# EAGLE design Controller Board v11 (EAGLE 5.06)
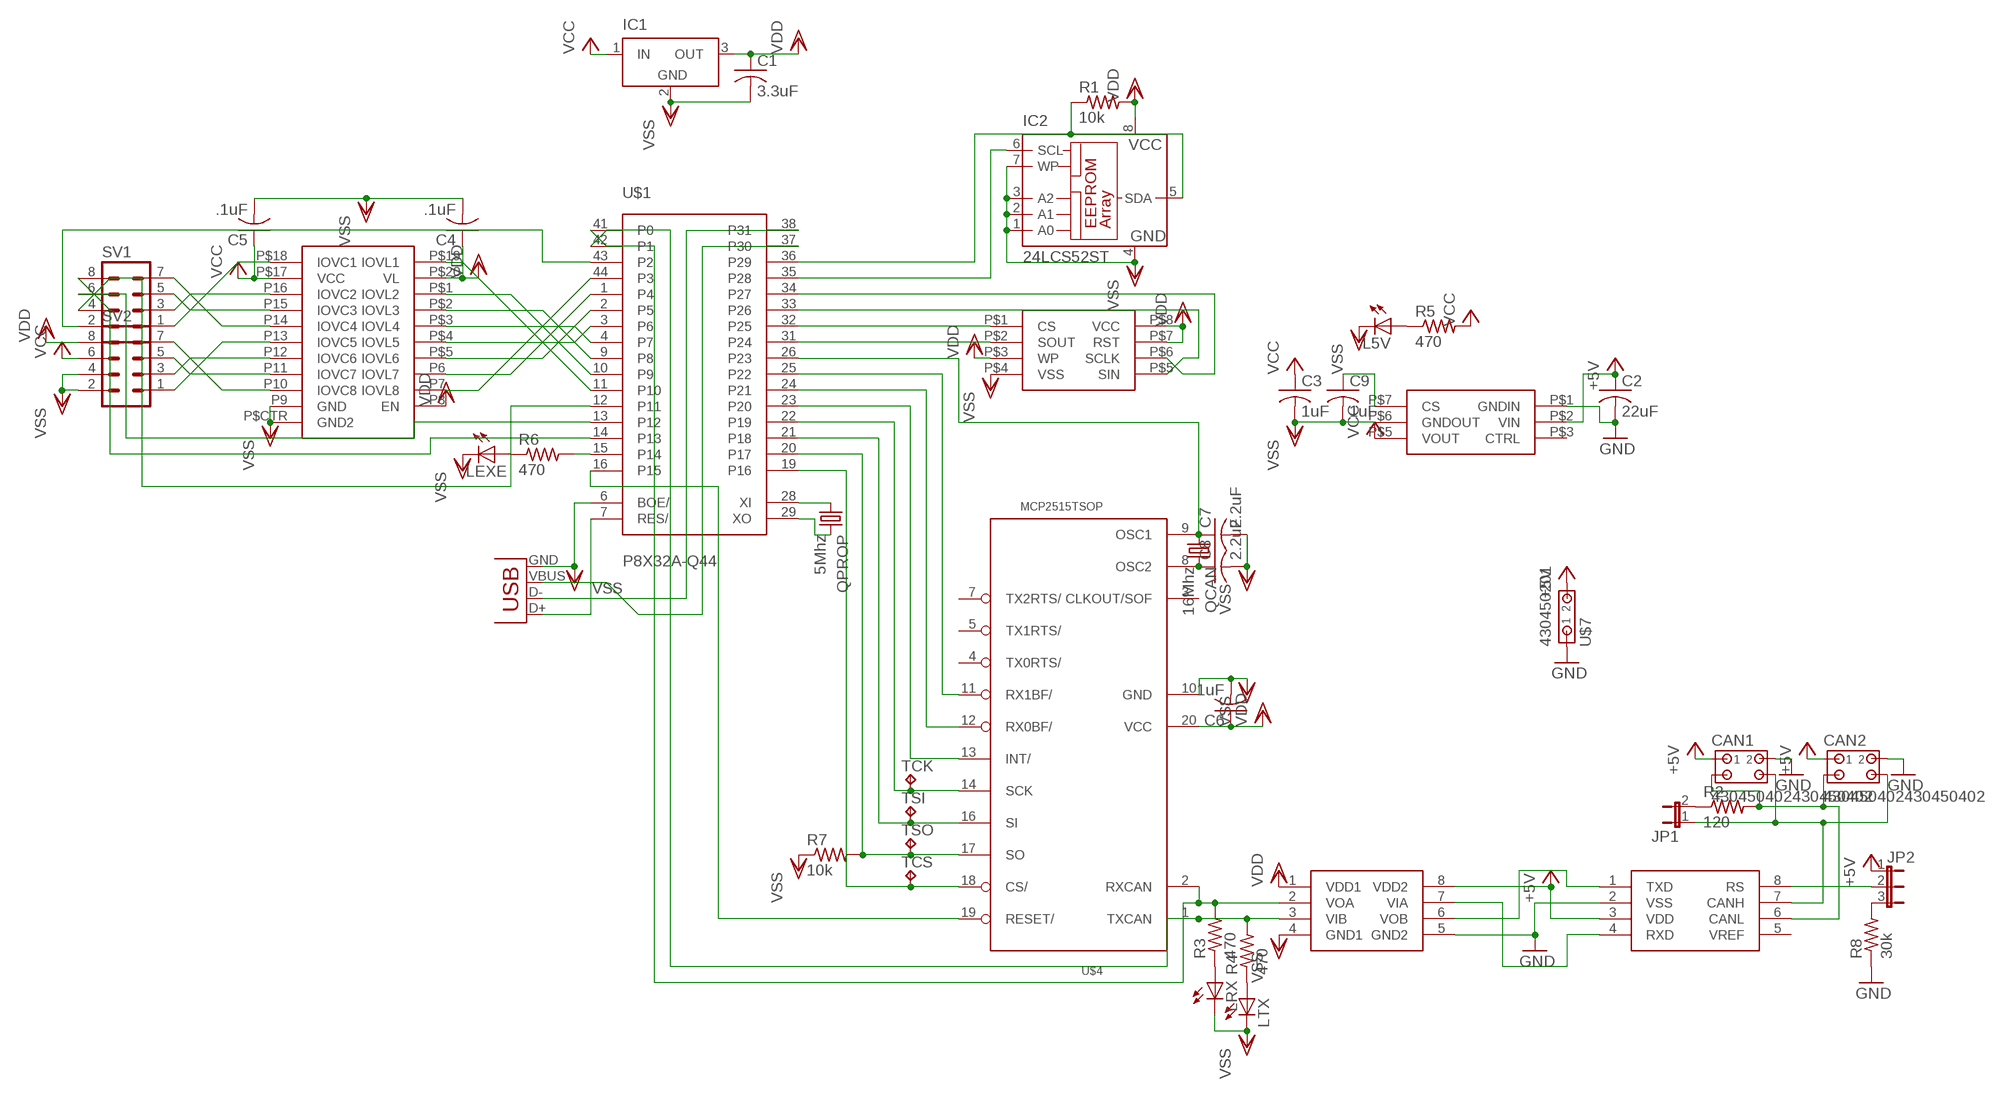
[diagram p0: schematic, sheet 1]

## Parts
C1  3.3uF  C-USC0805  [C0805]
C2  22uF  C-USC1210  [C1210]
C3  1uF  C-USC0805  [C0805]
C4  .1uF  C-USC0805  [C0805]
C5  .1uF  C-USC0805  [C0805]
C6  1uF  C-USC0805  [C0805]
C7  2.2uF  C-USC0805  [C0805]
C8  2.2uF  C-USC0805  [C0805]
C9  1uF  C-USC0805  [C0805]
CAN1  430450402430450402  [430450402]
CAN2  430450402430450402  [430450402]
IC1  LT1129CST5  [SOT223]
IC2  24LCS52ST  [TSSOP8]
JP1  JP1E  [JP1]
JP2  JP2W  [JP2W]
L5V  LEDCHIP-LED0805  [CHIP-LED0805]
LEXE  LEDCHIP-LED0805  [CHIP-LED0805]
LRX  LEDCHIP-LED0805  [CHIP-LED0805]
LTX  LEDCHIP-LED0805  [CHIP-LED0805]
QCAN  16Mhz  CRYSTALHC49UP  [HC49UP]
QPROP  5Mhz  CRYSTALHC49UP  [HC49UP]
R1  10k  R-US_R0603  [R0603]
R2  120  R-US_R0603  [R0603]
R3  470  R-US_R0603  [R0603]
R4  470  R-US_R0603  [R0603]
R5  470  R-US_R0603  [R0603]
R6  470  R-US_R0603  [R0603]
R7  10k  R-US_R0603  [R0603]
R8  30k  R-US_R0603  [R0603]
SV1  MA04-2  [MA04-2]
SV2  MA04-2  [MA04-2]
TCK  TPPAD1-13  [P1-13]
TCS  TPPAD1-13  [P1-13]
TSI  TPPAD1-13  [P1-13]
TSO  TPPAD1-13  [P1-13]
U1  MCP2551  [SO08]
U$1  P8X32A-Q44  [P8X32A-Q44]
U$2  VINF-VWRBS2  [VINF-VWRBS2]
U$3  ADUM1201  [SO8]
U$4  MCP2515TSOP  [TSSOP20]
U$5  M25PE20  [S08N]
U$6  MAX3000E  [TQFN-20]
U$7  430450201  [430450201]
X1  USBSMD  [USB-MINIB]

## Nets
+5V: C2.1 CAN1.P$1 CAN2.P$1 JP2.1 U1.3(VDD) U$2.P$2(VIN) U$3.8(VDD2) U$7.P$2
FLASHCLK: U$1.34(P27) U$5.P$6(SCLK)
FLASHSIN: U$1.33(P26) U$5.P$5(SIN)
GND: C2.2 CAN1.P$2 CAN2.P$2 R8.1 U1.2(VSS) U$2.P$1(GNDIN) U$3.5(GND2) U$7.P$1
N$1: QPROP.1 U$1.28(XI)
N$2: QPROP.2 U$1.29(XO)
N$3: IC2.6(SCL) U$1.35(P28)
N$4: IC2.5(SDA) R1.1 U$1.36(P29)
N$5: U$1.7(RES/) X1.D+
N$6: U$1.38(P31) X1.D-
N$7: U$1.37(P30) X1.VBUS
N$8: U$1.25(P22) U$4.11(RX1BF/)
N$9: U$1.24(P21) U$4.12(RX0BF/)
N$10: CAN1.P$3 CAN2.P$3 R2.2 U1.6(CANL)
N$11: CAN1.P$4 CAN2.P$4 JP1.1 U1.7(CANH)
N$12: R6.2 U$1.15(P14)
N$13: C9.1 U$2.P$7(CS)
N$14: U$1.32(P25) U$5.P$1(CS)
N$15: U$1.31(P24) U$5.P$2(SOUT)
N$16: U$1.23(P20) U$4.13(INT/)
N$17: TCK.1(TP) U$1.22(P19) U$4.14(SCK)
N$18: C7.1 QCAN.1 U$1.26(P23) U$4.9(OSC1)
N$19: C8.1 QCAN.2 U$4.8(OSC2)
N$20: R3.2 U$1.41(P0) U$3.2(VOA) U$4.2(RXCAN)
N$21: R4.2 U$1.42(P1) U$3.3(VIB) U$4.1(TXCAN)
N$22: JP1.2 R2.1
N$23: TSI.1(TP) U$1.21(P18) U$4.16(SI)
N$24: TCS.1(TP) U$1.19(P16) U$4.18(CS/)
N$25: U$1.16(P15) U$4.19(RESET/)
N$26: LRX.A R3.1
N$27: U$1.11(P10) U$6.P$19(IOVL1)
N$28: SV2.7 U$6.P10(IOVC8)
N$29: SV2.5 U$6.P11(IOVC7)
N$30: U$1.10(P9) U$6.P$1(IOVL2)
N$31: U$1.9(P8) U$6.P$2(IOVL3)
N$32: U$1.4(P7) U$6.P$3(IOVL4)
N$33: U$1.3(P6) U$6.P$4(IOVL5)
N$34: U$1.2(P5) U$6.P$5(IOVL6)
N$35: U$1.1(P4) U$6.P6(IOVL7)
N$36: U$1.44(P3) U$6.P7(IOVL8)
N$37: SV2.3 U$6.P12(IOVC6)
N$38: SV2.1 U$6.P13(IOVC5)
N$39: SV1.7 U$6.P14(IOVC4)
N$40: SV1.1 U$6.P$18(IOVC1)
N$41: SV1.3 U$6.P16(IOVC2)
N$42: SV1.5 U$6.P15(IOVC3)
N$43: SV1.8 U$1.14(P13)
N$44: R7.2 TSO.1(TP) U$1.20(P17) U$4.17(SO)
N$45: SV1.6 U$1.13(P12)
N$46: LTX.A R4.1
N$47: L5V.A R5.1
N$48: LEXE.A R6.1
N$49: SV1.4 U$1.12(P11)
N$50: SV1.2 U$1.43(P2)
N$51: JP2.2 U1.8(RS)
N$52: JP2.3 R8.2
N$53: U1.1(TXD) U$3.6(VOB)
N$54: U1.4(RXD) U$3.7(VIA)
VCC: C3.1 C5.1 IC1.1(IN) R5.2 SV2.6 U$2.P$5(VOUT) U$6.P$17(VCC)
VDD: C1.1 C4.1 C6.1 IC1.3(OUT) IC2.8(VCC) R1.2 SV2.8 U$3.1(VDD1) U$4.20(VCC) U$5.P$3(WP) U$5.P$7(RST) U$5.P$8(VCC) U$6.P8(EN) U$6.P$20(VL)
VSS: C1.2 C3.2 C4.2 C5.2 C6.2 C7.2 C8.2 C9.2 IC1.2(GND) IC2.1(A0) IC2.2(A1) IC2.3(A2) IC2.4(GND) IC2.7(WP) L5V.C LEXE.C LRX.C LTX.C R7.1 SV2.2 SV2.4 U$1.6(BOE/) U$2.P$6(GNDOUT) U$3.4(GND1) U$4.10(GND) U$5.P$4(VSS) U$6.P9(GND) U$6.P$CTR(GND2) X1.GND
Unconnected: U1.5(VREF) U$2.P$3(CTRL) U$4.3(CLKOUT/SOF) U$4.4(TX0RTS/) U$4.5(TX1RTS/) U$4.7(TX2RTS/)

## Power pins joined to a net without a drawn wire
VDD: U$1.8(VDD) U$1.18(VDD) U$1.30(VDD) U$1.40(VDD)
VSS: IC1.4(GND) U$1.5(VSS) U$1.17(VSS) U$1.27(VSS) U$1.39(VSS)

## Library data of the parts
C1 C2 C4-C8 = rcl:C-US: CAPACITOR, American symbol
C3 C9 = resistor:C-US: CAPACITOR, American symbol
CAN1 CAN2 = con-amp:430450402
IC1 = linear-technology:LT1129CST5: VOLTAGE REGULATOR with shutdown
IC2 = microchip:24*: Serial EEPROM I2C
JP1 = jumper:JP1E: JUMPER
JP2 = jumper:JP2W: JUMPER
L5V LEXE LRX LTX = led:LED: LED OSRAM: - CHIPLED LG R971, LG N971, LY N971, LG Q971, LY Q971, LO R971, LY R971 LH N974, LH R974 LS Q976, LO Q976, LY Q976 LO Q996 - Hyper CHIPLED LW Q18S LB Q993, LB Q99A, LB R99A - SideLED LS A670, LO A670, LY A670, LG A670, LP A670 LB A673, LV A673, LT A673, LW A673 LH A674 LY A675 LS A676, LA A676, LO A676, LY A676, LW A676 LS A679, LY A679, LG A679 - Hyper Micro SIDELED® LS Y876, LA Y876, LO Y876, LY Y876 LT Y87S - SmartLED LW L88C, LW L88S LB L89C, LB L89S, LG L890 LS L89K, LO L89K, LY L89K LS L896, LA L896, LO L896, LY L896 - TOPLED LS T670, LO T670, LY T670, LG T670, LP T670 LSG T670, LSP T670, LSY T670, LOP T670, LYG T670 LG T671, LOG T671, LSG T671 LB T673, LV T673, LT T673, LW T673 LH T674 LS T676, LA T676, LO T676, LY T676, LB T676, LH T676, LSB T676, LW T676 LB T67C, LV T67C, LT T67C, LS T67K, LO T67K, LY T67K, LW E67C LS E67B, LA E67B, LO E67B, LY E67B, LB E67C, LV E67C, LT E67C LW T67C LS T679, LY T679, LG T679 LS T770, LO T770, LY T770, LG T770, LP T770 LB T773, LV T773, LT T773, LW T773 LH T774 LS E675, LA E675, LY E675, LS T675 LS T776, LA T776, LO T776, LY T776, LB T776 LHGB T686 LT T68C, LB T68C - Hyper Mini TOPLED® LB M676 - Mini TOPLED Santana® LG M470 LS M47K, LO M47K, LY M47K Source: http://www.osram.convergy.de LUXEON: - LUMILED® LXK2-PW12-R00, LXK2-PW12-S00, LXK2-PW14-U00, LXK2-PW14-V00 LXK2-PM12-R00, LXK2-PM12-S00, LXK2-PM14-U00 LXK2-PE12-Q00, LXK2-PE12-R00, LXK2-PE12-S00, LXK2-PE14-T00, LXK2-PE14-U00 LXK2-PB12-K00, LXK2-PB12-L00, LXK2-PB12-M00, LXK2-PB14-N00, LXK2-PB14-P00, LXK2-PB14-Q00 LXK2-PR12-L00, LXK2-PR12-M00, LXK2-PR14-Q00, LXK2-PR14-R00 LXK2-PD12-Q00, LXK2-PD12-R00, LXK2-PD12-S00 LXK2-PH12-R00, LXK2-PH12-S00 LXK2-PL12-P00, LXK2-PL12-Q00, LXK2-PL12-R00 Source: www.luxeon.com KINGBRIGHT: KA-3528ASYC Source: www.kingbright.com
QCAN QPROP = crystal:CRYSTAL: CRYSTAL
R1-R8 = rcl:R-US_: RESISTOR, American symbol
SV1 SV2 = con-lstb:MA04-2: PIN HEADER
TCK TCS TSI TSO = testpad:TP: Test pad
U1 = SparkFun:MCP2551
U$1 = parallax_propeller:P8X32A-Q44
U$2 = dc-dc-converter:VINF-VWRBS2
U$3 = analog-devices:ADUM1201
U$4 = MCP2515_MT:MCP2515*: MCP2515 Standalone CAN-Controller by Microchip Eagle-Lib. by MartinThomas
U$5 = Flash:M25PE20
U$6 = Level Shifters:MAX3000E
U$7 = con-amp:430450201
X1 = SparkFun:USB: USB Connectors USB-B-PTH is fully proven SKU : PRT-00139 USB-miniB is fully proven SKU : PRT-00587 USB-A-PCB is untested. USB-A-H is throughly reviewed, but untested. Spark Fun Electronics SKU : PRT-00437 USB-B-SMT is throughly reviewed, but untested. Needs silkscreen touching up. USB-A-S has not been used/tested USB-MB-H has not been used/tested

## Board
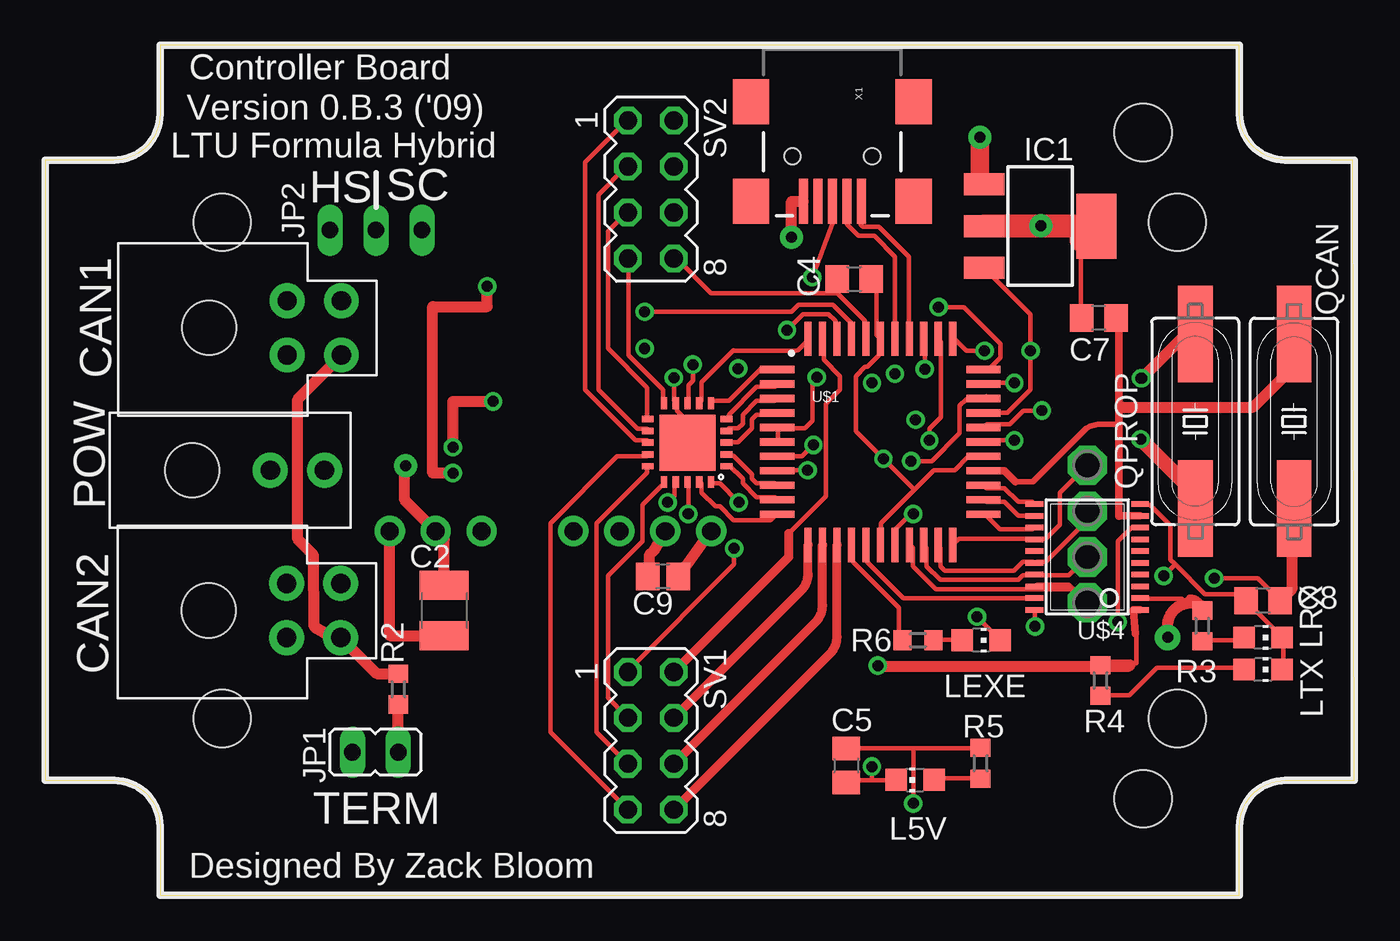
[diagram p1: board, top side]
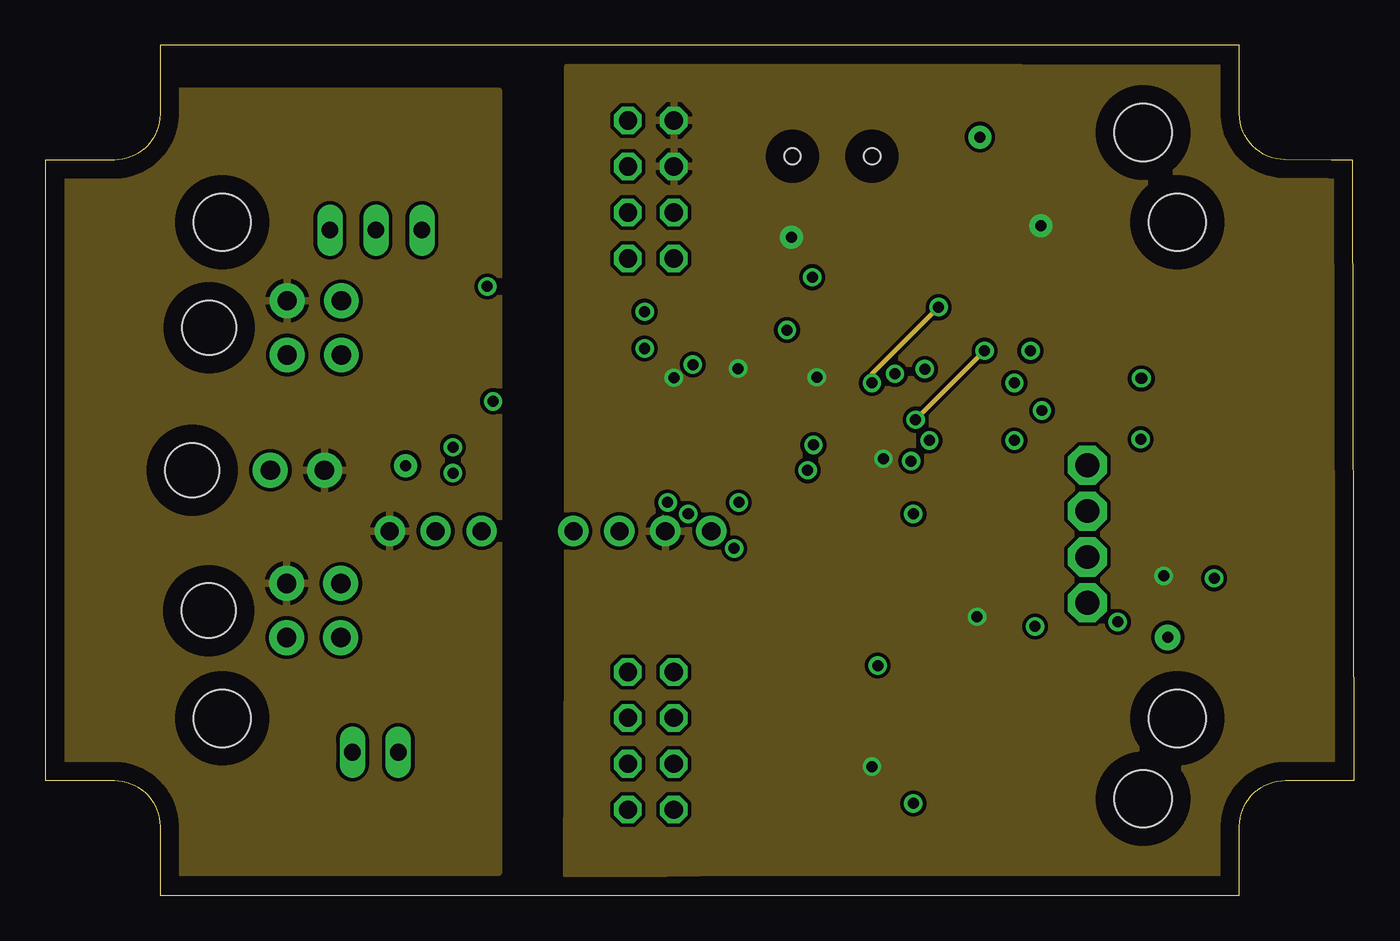
[diagram p2: board, inner layer Route2]
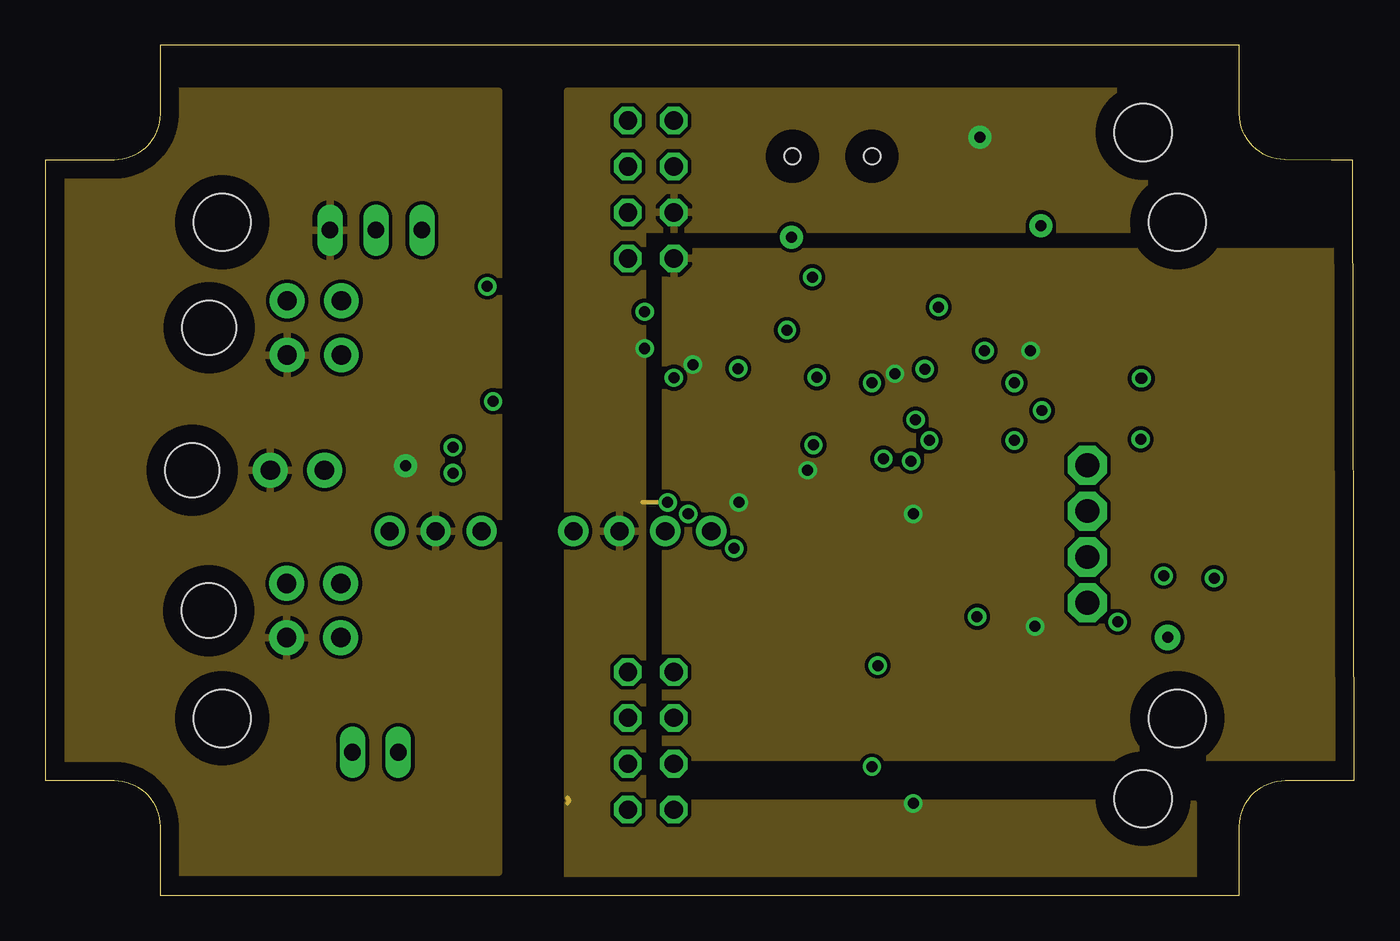
[diagram p3: board, inner layer Route15]
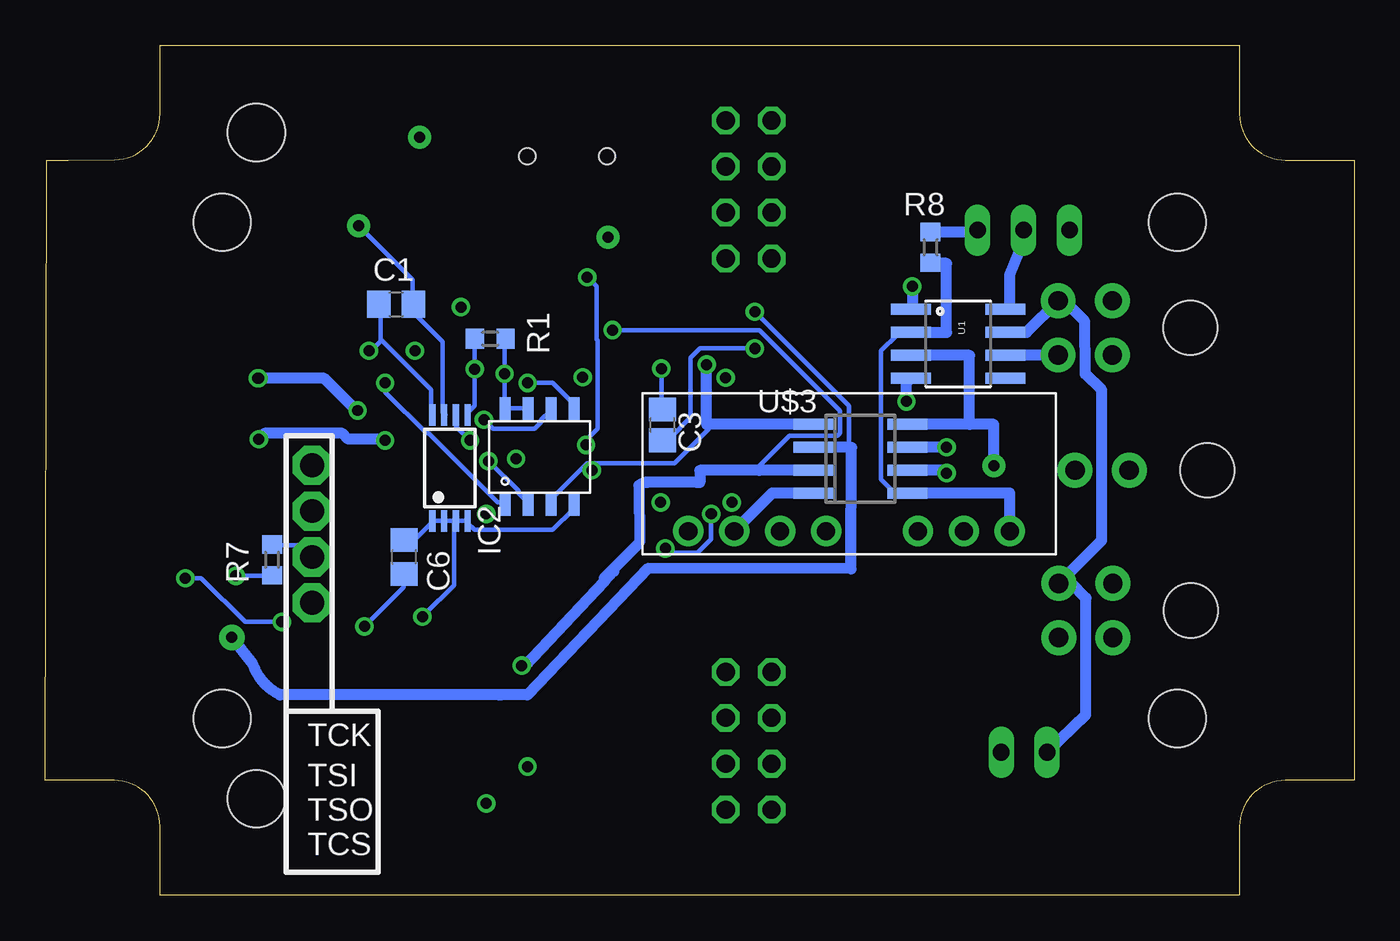
[diagram p4: board, bottom side, seen from below]

Size 72.39 x 46.99 mm. Coordinates in mm from the lower left corner, seen from the top.
Outline: 72.39,6.35 72.31,40.64 71.12,40.64 68.56,40.66 arc-89 66.04,43.2 66.04,46.99 6.35,46.99 6.35,43.18 arc-90 3.81,40.64 0,40.64 0,6.35 3.81,6.35 arc-90 6.35,3.81 6.35,0 66.04,0 66.04,3.81 arc-90 68.58,6.35 72.39,6.35
Copper layers (1*2+15*16): Top 0.035mm / dielectric 0.2mm / Route2 0.035mm / dielectric 1.5mm / Route15 0.035mm / dielectric 0.2mm / Bottom 0.035mm
Design rules "4 layer": minimum track width 10mil, minimum drill 24mil, track to track 8mil, track to pad 8mil, pad to pad 8mil, via to via 8mil, smd to smd 8mil, copper to edge 40mil, drill to drill 8mil, minimum pad ring 10mil, minimum via ring 8mil, stop-mask expansion 4mil, vias tented up to drill 0mil, thermal gap 10mil
Holes 3.17 mm at 62.61,37.21 62.61,9.78 9.78,9.78 9.78,37.21 60.71,5.33 60.71,42.16
tKeepout: area 26.3,6.7 to 27,39.1

### Footprints (pad centres in the part's own frame; a part is rotated, then mirrored left to right if it is on the bottom)
C0805 = smd 1.3 x 1.5: 1 -0.95,0; 2 0.95,0
C1210 = smd 1.6 x 2.7: 1 -1.4,0; 2 1.4,0
C0805' = smd 1.3 x 1.5: 1 -0.85,0; 2 0.85,0
430450402 = drill 1.067 pad 1.93 round: P$1 2.997,2.997; P$2 0,2.997; P$3 2.997,5.994; P$4 0,5.994 | hole 2.997: 1.499,-1.321
SOT223 = smd 1.219 x 2.235: 1 -2.311,-3.099; 2 0,-3.099; 3 2.311,-3.099 | smd 3.6 x 2.2: 4 0,3.099
TSSOP8 = smd 0.35 x 1.2: 1 -0.975,-2.925; 2 -0.325,-2.925; 3 0.325,-2.925; 4 0.975,-2.925; 5 0.975,2.925; 6 0.325,2.925; 7 -0.325,2.925; 8 -0.975,2.925
JP1 = drill 0.914 long: 1 0,-1.27; 2 0,1.27
JP2W = drill 0.914 long: 1 -2.54,-1.27; 2 0,-1.27; 3 2.54,-1.27
CHIP-LED0805 = smd 1.2 x 1.2: A 0,-1.05; C 0,1.05
HC49UP = smd 5.334 x 1.93: 1 -4.826,0; 2 4.826,0
R0603 = smd 1 x 1.1: 1 -0.85,0; 2 0.85,0
MA04-2 = drill 1.016 octagon: 1 -3.81,-1.27; 2 -3.81,1.27; 3 -1.27,-1.27; 4 -1.27,1.27; 5 1.27,-1.27; 6 1.27,1.27; 7 3.81,-1.27; 8 3.81,1.27
P1-13 = drill 1.321 pad 2.159 octagon: 1 0,0
SO08 = smd 0.61 x 2.21: 1 -1.905,-2.616; 2 -0.635,-2.616; 3 0.635,-2.616; 4 1.905,-2.616; 5 1.905,2.616; 6 0.635,2.616; 7 -0.635,2.616; 8 -1.905,2.616
P8X32A-Q44 = smd 1.9 x 0.4: 1 -5.713,4.013; 2 -5.713,3.212; 3 -5.713,2.413; 4 -5.713,1.613; 5 -5.713,0.812; 6 -5.713,0.013; 7 -5.713,-0.787; 8 -5.713,-1.587; 9 -5.713,-2.388; 10 -5.713,-3.188; 11 -5.713,-3.987; 23 5.688,-3.987; 24 5.688,-3.188; 25 5.688,-2.388; 26 5.688,-1.587; 27 5.688,-0.787; 28 5.688,0.013; 29 5.688,0.812; 30 5.688,1.613; 31 5.688,2.413; 32 5.688,3.212; 33 5.688,4.013 | smd 0.4 x 1.9: 12 -4.013,-5.688; 13 -3.212,-5.688; 14 -2.413,-5.688; 15 -1.613,-5.688; 16 -0.812,-5.688; 17 -0.013,-5.688; 18 0.787,-5.688; 19 1.587,-5.688; 20 2.388,-5.688; 21 3.188,-5.688; 22 3.987,-5.688; 34 3.987,5.713; 35 3.188,5.713; 36 2.388,5.713; 37 1.587,5.713; 38 0.787,5.713; 39 -0.013,5.713; 40 -0.812,5.713; 41 -1.613,5.713; 42 -2.413,5.713; 43 -3.212,5.713; 44 -4.013,5.713
VINF-VWRBS2 = drill 1 pad 1.676 round: P$1 -12.7,5.08; P$2 -10.16,5.08; P$3 -7.62,5.08; P$4 -2.54,5.08; P$5 0,5.08; P$6 2.54,5.08; P$7 5.08,5.08
SO8 = smd 0.6 x 2.2: 1 -1.905,-2.6; 2 -0.635,-2.6; 3 0.635,-2.6; 4 1.905,-2.6; 5 1.905,2.6; 6 0.635,2.6; 7 -0.635,2.6; 8 -1.905,2.6
TSSOP20 = smd 0.305 x 0.991: 1 -2.925,-2.918; 2 -2.275,-2.918; 3 -1.625,-2.918; 4 -0.975,-2.918; 5 -0.325,-2.918; 6 0.325,-2.918; 7 0.975,-2.918; 8 1.625,-2.918; 9 2.275,-2.918; 10 2.925,-2.918; 11 2.925,2.918; 12 2.275,2.918; 13 1.625,2.918; 14 0.975,2.918; 15 0.325,2.918; 16 -0.325,2.918; 17 -0.975,2.918; 18 -1.625,2.918; 19 -2.275,2.918; 20 -2.925,2.918
S08N = smd 0.6 x 1.3: P$1 -2.54,-2.667; P$2 -1.27,-2.667; P$3 0,-2.667; P$4 1.27,-2.667; P$5 1.27,2.587; P$6 0,2.587; P$7 -1.27,2.587; P$8 -2.54,2.587
TQFN-20 = smd 0.65 x 0.35: P6 0.875,-1.1; P7 0.875,-0.45; P8 0.875,0.2; P9 0.875,0.85; P10 0.875,1.5; P16 -3.475,1.5; P$17 -3.475,0.85; P$18 -3.475,0.2; P$19 -3.475,-0.45; P$20 -3.475,-1.1 | smd 0.35 x 0.65: P11 0,2.4; P12 -0.65,2.4; P13 -1.3,2.4; P14 -1.95,2.4; P15 -2.6,2.4; P$1 -2.6,-1.95; P$2 -1.95,-1.95; P$3 -1.3,-1.95; P$4 -0.65,-1.95; P$5 0,-1.95 | smd 3.099 x 3.099: P$CTR -1.3,0.2
430450201 = drill 1.067 pad 1.93 round: P$1 0,2.997; P$2 0,0 | hole 2.997: 0,-4.318
USB-MINIB = smd 2.5 x 0.5: D+ 2.5,0; D- 2.5,0.8; GND 2.5,-1.6; ID 2.5,-0.8; VBUS 2.5,1.6 | smd 2.5 x 2: GND@1 -3,-4.5; GND@2 -3,4.5; GND@3 2.5,4.5; GND@4 2.5,-4.5 | hole 0.9: 0,2.2; 0,-2.2

### Placement (x,y rotation side)
C1  52.99,32.67 0 bottom
C2  22.07,15.75 270 top
C3  1uF  [C0805']  38.26,26 90 bottom
C4  44.74,34.07 0 top
C5  44.29,7.18 270 top
C6  52.55,18.7 90 bottom
C7  58.26,31.91 180 top
C8  67.34,16.29 180 top
C9  1uF  [C0805']  34.16,17.62 180 top
CAN1  10.38,32.86 270 top
CAN2  10.35,17.24 270 top
IC1  55.02,36.99 270 top
IC2  50.01,23.62 0 bottom
JP1  18.26,7.91 270 top
JP2  18.29,38.04 0 top
L5V  48.1,6.38 90 top
LEXE  51.75,14.1 270 top
LRX  67.34,14.26 270 top
LTX  67.34,12.48 270 top
QCAN  69.06,26.19 270 top
QPROP  63.6,26.19 90 top
R1  47.78,30.77 0 bottom
R2  19.53,11.4 90 top
R3  63.98,14.89 90 top
R4  58.36,11.87 90 top
R5  51.72,7.3 90 top
R6  48.26,14.1 180 top
R7  59.85,18.54 90 bottom
R8  23.43,35.81 90 bottom
SV1  33.5,8.54 270 top
SV2  33.5,39.02 270 top
TCK  57.63,23.78 0 top
TCS  57.63,16.16 0 top
TSI  57.63,21.24 0 top
TSO  57.63,18.7 0 top
U1  21.91,30.48 270 bottom
U$1  46.2,25.05 0 top
U$2  31.75,25.21 180 bottom
U$3  27.3,24.13 270 bottom
U$4  57.63,18.7 90 top
U$5  44.42,24.29 0 bottom
U$6  35.72,26.32 90 top
U$7  12.45,23.5 270 top
X1  43.53,40.86 270 top

### Tracks (layer width: path | path; a pad name or v marks a point on that pad's centre or on a via)
+5V  (via drill 0.61 pad 1.27)
  Top 0.61: C2.1 22.07,19.65 U$2.P$2 19.88,21.84 19.88,23.81
  Bottom 0.61: 21.27,26.04 U$3.8 | U1.3 21.27,29.84 21.27,26.04 | 21.27,26.04 19.94,26.04 v19.94,23.75
  pour Route15: 1.27,44.45 1.27,1.27 25.08,1.27 25.08,44.45
FLASHCLK  (via drill 0.61)
  Top 0.254: v51.94,30.1 50.93,30.1 50.29,30.73 U$1.34
  Route2 0.254: v48.13,26.29 v51.94,30.1
  Bottom 0.254: v48.13,26.29 47.62,25.78 45.34,25.78 44.96,26.16 44.96,26.29 44.45,26.8 U$5.P$6
FLASHSIN  (via drill 0.61)
  Top 0.254: v49.4,32.51 50.8,32.51 52.83,30.48 52.83,29.72 52.2,29.08 51.94,29.08 U$1.33
  Route2 0.254: v45.72,28.32 45.72,28.83 v49.4,32.51
  Bottom 0.254: v45.72,28.32 44.32,28.32 43.18,27.18 43.18,26.92 U$5.P$5
GND
  Top 0.61: C2.2 19.05,14.35 U$2.P$1
  Bottom 0.254: U1.2 24.77,30.99 25.27,30.99 26.16,30.1 26.16,22.99 25.53,22.35 24.89,22.35 U$3.5
  Bottom 0.61: U$3.5 19.05,22.23 U$2.P$1 | U1.2 22.54,31.11 22.54,34.92 23.43,34.92 R8.1
  pour Route2: 25.08,44.45 25.08,1.27 1.27,1.27 1.27,44.45
N$1  (via drill 0.61)
  Top 0.254: v53.59,25.15 51.94,25.15 U$1.28 | 63.63,21.34 QPROP.1
  Top 0.61: v53.59,25.15 53.66,25.21
  Top 0.813: 63.63,21.34 63.63,22.16 v60.58,25.21
  Bottom 0.61: v60.58,25.21 60.26,25.53 55.94,25.53 55.63,25.21 53.59,25.21 v53.59,25.15
N$2  (via drill 0.6)
  Top 0.254: v55.12,26.8 54.1,26.8 53.34,26.04 52.07,26.04 51.94,25.91 U$1.29
  Top 0.61: QPROP.2 63.09,31.02 v60.64,28.57
  Bottom 0.254: v55.12,26.8 55.15,26.77
  Bottom 0.61: v60.64,28.57 56.96,28.57 55.15,26.77 55.12,26.73
N$3  (via drill 0.61)
  Top 0.254: v48.9,25.15 48.9,25.78 49.53,26.42 49.53,30.61 49.4,30.73 U$1.35
  Bottom 0.254: v48.9,25.15 49.66,25.91 49.66,26.54 IC2.6
N$4  (via drill 0.61)
  Top 0.254: v48.64,29.08 48.64,30.73 U$1.36
  Bottom 0.254: R1.1 48.64,30.73 v48.64,29.08 48.64,27.05 49.02,26.67 IC2.5
N$5  (via drill 0.61)
  Top 0.254: v42.42,34.16 43.56,37.21 43.56,38.35 X1.D+ | U$1.7 40.51,24.26 41.85,24.26 v42.48,24.89
  Bottom 0.254: v42.48,24.89 42.48,25.15 41.85,25.78 41.85,30.67 41.91,30.73 41.91,33.66 v42.42,34.16
N$6
  Top 0.254: U$1.38 46.99,30.86 46.99,35.31 45.85,36.45 44.96,36.45 44.32,37.08 X1.D-
N$7
  Top 0.254: U$1.37 47.75,30.86 47.75,35.31 46.1,36.96 45.21,36.96 45.09,37.08 45.09,38.35 X1.VBUS
N$8
  Top 0.254: U$4.11 54.58,21.75 53.82,21.75 53.05,22.51 52.04,22.51 U$1.25
N$9
  Top 0.254: U$1.24 52.04,21.75 53.05,21.75 53.82,20.99 54.58,20.99 U$4.12
N$10
  Top 0.61: R2.2 18.34,12.25 CAN2.P$3 15.92,14.24 14.87,14.86 14.83,18.79 13.97,19.68 13.97,27.42 16.38,29.83 CAN1.P$3
  Bottom 0.61: U1.6 19.27,29.86 CAN1.P$3
N$11
  Bottom 0.61: U1.7 18.12,31.11 CAN1.P$4 16.03,32.86 14.91,31.73 14.87,28.82 13.97,27.94 13.97,19.61 CAN2.P$4 15.65,17.24 14.83,16.43 14.85,9.97 JP1.1
N$12
  Top 0.254: R6.2 47.21,14.13 47.21,15.91 44.67,18.45 44.67,19.21 U$1.15
N$13
  Top 0.61: C9.1 U$2.P$7
N$14  (via drill 0.61)
  Top 0.254: v53.59,28.32 51.94,28.32 U$1.32
  Bottom 0.254: v53.59,28.32 53.59,27.81 51.31,25.53 51.18,25.53 47.37,21.72 46.99,21.72 U$5.P$1
N$15  (via drill 0.61)
  Top 0.254: 52.04,27.59 U$1.31 51.82,27.43 50.93,27.43 50.55,27.05 50.55,25.53 49.02,24 v47.88,24
  Bottom 0.254: v47.88,24 46.23,22.35 46.23,22.23 45.72,21.72 U$5.P$2
N$16
  Top 0.254: U$4.13 54.58,20.23 52.8,20.23 52.04,20.99 U$1.23
N$17
  Top 0.254: U$1.22 50.26,19.46 50.51,19.72 54.58,19.72 U$4.14 54.83,19.72 55.34,19.72 56.1,20.48 56.1,22.26 TCK.1 | TCK.1
N$18
  Top 0.254: 59.31,31.88 C7.1 | 68.96,30.99 QCAN.1 | 59.37,26.73 59.44,26.73 59.56,26.99
  Top 0.305: 53.66,22.86 54.61,22.86 57.41,25.66 arc-45 58.31,26.04 59.37,26.04
  Top 0.406: 59.31,31.88 59.37,31.81 59.37,26.73 59.37,26.04 59.37,20.95 59.39,20.98 U$4.9 | U$1.26 53.05,23.46 53.66,22.86
  Top 0.61: 68.96,30.99 68.96,29.15 66.8,26.99 59.56,26.99
N$19  (via drill 0.61)
  Top 0.254: v59.31,15.11 59.31,19.56 60.07,20.32 60.45,20.32 U$4.8 | v64.64,17.53 67.06,17.53 68.2,16.38 C8.1 | 68.96,21.34 QCAN.2
  Top 0.61: 68.96,21.34 68.96,16.96 C8.1
  Bottom 0.254: v59.31,15.11 61.34,15.11 63.75,17.53 v64.64,17.53
N$20  (via drill 0.61, 0.61 pad 1.42)
  Top 0.254: U$4.2 60.58,16.38 62.87,16.38 62.95,16.1 | v33.15,32.26 41.27,32.26 41.66,32.64 43.56,32.64 44.58,31.62 44.58,30.86 U$1.41
  Top 0.406: R3.2 arc90 63.29,16.43
  Top 0.61: R3.2 arc90 64.19,15.53 | R3.2 63.98,15.53 | v62.07,14.26 62.07,14.89 arc-72 62.95,16.1 arc-18 63.34,16.16 63.56,16.16 arc-90 R3.2
  Bottom 0.254: v33.15,32.26 27.94,27.05 27.94,25.02 27.8,24.77
  Bottom 0.61: v62.07,14.26 60.89,12.76 arc-45 59.4,11.08 47.31,11.08 | 47.31,11.08 47.16,11.08 | 47.31,11.08 45.72,11.08 39.05,18.07 27.82,18.04 27.8,24.77 U$3.2
N$21  (via drill 0.61)
  Top 0.254: 60.29,14.47 60.33,14.35 60.33,12.83 60,12.73 | v46.04,12.7 46.1,12.7 46.1,12.67 | v41.02,31.24 41.91,32.13 43.31,32.13 43.69,31.75 43.69,30.86 U$1.42
  Top 0.406: 60.29,14.47 60.17,15.78 U$4.1
  Top 0.61: 45.88,12.67 46.1,12.67 59.93,12.67 arc-45 60,12.73 R4.2
  Bottom 0.254: v46.04,12.7 46.1,12.7 45.88,12.67 | v41.02,31.24 32.89,31.24 28.45,26.8 28.45,25.53 28.57,25.4 31.24,25.4 32.89,23.75 32.89,23.5
  Bottom 0.61: 41.49,17.34 45.88,12.67 | 41.49,17.34 40.96,17.91 | 41.49,17.34 41.49,17.54 39.53,19.5 39.56,22.64 arc45 39.11,22.83 36.35,22.83 36.2,22.83 36.2,23.5 32.89,23.5 U$3.3
N$22
  Top 0.61: JP1.2 R2.1
N$23
  Top 0.254: TSI.1 57.63,20.73 55.34,18.45 54.83,18.45 U$4.16 54.58,18.45 54.07,18.45 53.56,17.94 49.75,17.94 49.5,18.19 49.5,19.21 U$1.21
N$24
  Top 0.254: 56.86,16.92 56.61,17.18 54.83,17.18 U$4.18 | 56.86,16.92 49.24,16.92 47.97,18.19 47.97,19.21 U$1.19 | 56.86,16.92 TCS.1
N$25
  Top 0.254: U$4.19 54.58,16.41 47.47,16.41 45.43,18.45 45.43,19.21 U$1.16
N$26
  Top 0.254: 64.26,14.1 64.01,14.1 R3.1 64.26,14.1 | 64.26,14.1 66.04,14.1 66.17,14.22 LRX.A
N$27
  Top 0.254: U$6.P$19 36.29,22.77 36.29,22.26 37.05,21.5 37.31,21.5 38.07,20.73 40.1,20.73 40.35,20.99 U$1.11
N$28
  Top 0.254: U$6.P10 34.16,27.3 34.16,27.94 32.26,29.84 32.26,35.18 SV2.7
N$29
  Top 0.254: U$6.P11 33.27,26.42 33.27,28.07 31.11,30.23 31.11,36.7 32.13,37.72 SV2.5
N$30
  Top 0.254: U$6.P$1 37.81,23.78 38.58,23.02 38.58,22.77 39.34,22 40.35,22 U$1.10
N$31
  Top 0.254: U$6.P$2 37.81,24.29 38.07,24.29 39.08,23.27 39.08,23.02 39.34,22.77 40.35,22.77 U$1.9
N$32
  Top 0.254: U$6.P$3 37.81,25.05 38.32,25.05 39.08,25.81 39.08,26.32 39.34,26.57 40.35,26.57 U$1.4
N$33
  Top 0.254: U$6.P$4 37.81,25.81 38.32,25.81 38.58,26.07 38.58,26.57 39.34,27.34 40.35,27.34 U$1.3
N$34
  Top 0.254: U$6.P$5 37.81,26.32 37.81,26.57 39.34,28.1 40.35,28.1 U$1.2
N$35
  Top 0.254: U$6.P6 36.8,27.34 37.81,27.34 39.59,29.11 40.35,29.11 U$1.1
N$36
  Top 0.254: U$6.P7 36.29,27.34 36.29,28.35 38.07,30.13 38.1,30.1 41.53,30.1 41.62,30.13 42.13,30.64 U$1.44
N$37
  Top 0.254: U$6.P12 33.27,25.78 32.77,25.78 30.61,27.94 30.61,38.73 32.13,40.26 SV2.3
N$38
  Top 0.254: U$6.P13 33.27,25.15 32.64,25.15 29.84,27.94 29.84,40.51 32.13,42.8 SV2.1
N$39
  Top 0.254: U$6.P14 33.27,24.26 31.62,24.26 27.94,20.57 27.94,9.02 32.13,4.83 SV1.7
N$40  (via drill 0.61)
  Top 0.254: v35.56,21.08 35.56,22.73 U$6.P$18 | v38.1,19.18 38.1,18.29 32.26,12.45 SV1.1
  Bottom 0.254: v35.56,21.08 35.56,19.68 36.32,18.92 37.85,18.92 v38.1,19.18
N$41
  Top 0.254: U$6.P16 34.16,22.73 33.02,21.59 33.02,19.56 31.11,17.65 31.11,10.92 32.13,9.91 SV1.3
N$42
  Top 0.254: U$6.P15 33.27,23.62 33.27,23.37 30.48,20.57 30.48,9.02 32.13,7.37 SV1.5
N$43
  Top 0.508: SV1.8 43.41,13.38 arc45 43.78,14.27 U$1.14
N$44
  Top 0.254: TSO.1 56.61,17.68 54.83,17.68 U$4.17 54.58,17.68 54.07,17.68 53.82,17.43 49.5,17.43 48.74,18.19 48.74,19.21 U$1.20
  Bottom 0.254: TSO.1 58.26,19.34 59.69,19.34 R7.2
N$45
  Top 0.508: SV1.6 42.61,15.12 arc45 42.98,16.01 U$1.13
N$46
  Top 0.254: R4.1 58.42,11.05 59.94,11.05 61.47,12.57 66.17,12.57 LTX.A
N$47
  Top 0.254: R5.1 51.63,6.48 49.21,6.48 L5V.A
N$48
  Top 0.254: R6.1 49.24,14.13 50.51,14.13 LEXE.A
N$49
  Top 0.508: SV1.4 41.81,16.86 arc45 42.18,17.75 U$1.12
N$50
  Top 0.254: 42.93,30.86 U$1.43 43.05,30.73 43.05,29.59 43.94,28.7 43.94,27.94 43.18,27.18 43.18,22.07 41.12,20
  Top 0.508: 41.12,20 41.12,18.7 SV1.2
N$51
  Bottom 0.61: JP2.2 18.29,36.13 19.05,34.29 19.05,32.63 U1.8
N$52
  Bottom 0.254: 20.93,36.66 20.83,36.7 JP2.3
  Bottom 0.61: 20.93,36.66 R8.2
N$53  (via drill 0.61 pad 1.02)
  Top 0.61: v22.54,23.34 21.43,23.34 21.43,32.54 24.45,32.54 v24.45,33.66 | v22.54,23.34 22.7,23.34 | v22.54,23.34
  Bottom 0.61: U$3.6 22.54,23.5 v22.54,23.34 | U1.1 24.45,32.46 v24.45,33.66
N$54  (via drill 0.61 pad 1.02)
  Top 0.61: v24.77,27.3 22.54,27.3 v22.54,24.77
  Bottom 0.61: v22.54,24.77 U$3.7 | v22.54,24.77 | U1.4 24.77,28.33 v24.77,27.3
N$56  (via drill 0.6)
  other vias: 60.58,28.57
VCC  (via drill 0.61, 0.61 pad 1.27)
  Top 0.254: 48.01,8.13 44.39,8.13 C5.1 | 48.01,8.13 51.63,8.13 R5.2 | 48.01,8.13 v48.01,5.08 | v34.42,21.72 34.8,22.1 34.8,22.73 U$6.P$17
  Top 1.016: v51.69,41.91 51.69,39.37 51.73,39.24 IC1.1
  Route15 0.254: 28.89,5.08 28.96,5.21 28.89,5.4 | v34.42,21.72 33.02,21.72 | v33.15,30.23 33.02,30.23
  Bottom 0.254: v33.15,30.23 36.2,30.23 36.7,29.72 36.7,26.42 37.85,25.27 38.23,25.27 C3.1
  pour Route15: 28.89,44.45 28.89,5.4 33.02,5.08 33.02,44.45
  pour Route15: 33.02,44.45 33.02,36.83 60.96,36.83 60.96,5.08 72.39,5.08 72.39,44.45
  pour Route15: 28.89,5.08 28.89,0 63.5,0 63.5,5.08
VDD  (via drill 0.61)
  Top 0.254: U$6.P$20 36.8,22.77 37.31,22.77 38.32,21.75 v38.35,21.72 | v35.81,29.34 35.81,28.45 35.56,28.19 35.56,27.3 U$6.P8 | v54.74,14.86 54.74,15.75 U$4.20 | 34.8,35.18 SV2.8 34.92,35.18 36.83,33.27 43.81,33.27 | v42.16,23.5 40.51,23.5 U$1.8 | v48.01,21.08 47.88,21.08 46.99,20.19 46.99,19.43 U$1.18 | U$1.30 51.94,26.67 53.21,26.67 54.48,27.94 v54.48,30.1 54.48,32.13 51.94,34.67 IC1.3 | 43.81,33.27 43.81,34.04 C4.1 | 43.81,33.27 45.34,31.75 45.34,30.86 U$1.40
  Bottom 0.254: v54.74,14.86 52.58,17.02 52.58,17.65 C6.1 | R1.2 46.99,30.73 v46.99,28.83 46.99,26.92 U$5.P$8 46.86,26.92 45.72,26.92 U$5.P$7 | U$5.P$3 44.32,21.72 44.32,21.97 42.42,23.88 37.59,23.88 35.69,25.78 35.69,26.04 | 53.78,30.67 51.05,27.94 51.05,26.67 IC2.8 | v54.48,30.1 54.36,30.1 53.78,30.67 | C1.1 53.85,32.64 53.85,30.73 53.78,30.67
  Bottom 0.61: v35.81,29.34 35.81,26.04 35.69,26.04 U$3.1
  pour Route15: 34.29,35.56 34.29,7.62 72.07,7.62 71.75,35.56
VSS  (via drill 0.61, 0.61 pad 1.27)
  Top 0.254: v34.77,28.61 34.77,27.34 U$6.P9 34.92,27.18 34.92,26.8 35.43,26.29 35.43,25.15 U$6.P$CTR | v51.53,15.4 52.8,14.13 LEXE.C | 57.28,32 C7.2 57.28,32.13 57.28,36.2 58.04,36.96 IC1.4 | C4.2 45.97,33.66 45.97,30.99 46.1,30.86 U$1.39 46.1,30.73 46.1,29.84 45.47,29.21 45.34,29.21 44.83,28.7 44.83,25.65 v46.35,24.13 48.07,22.42 | 45.72,6.35 44.32,6.35 C5.2 | 45.72,6.35 46.99,6.35 L5V.C | 45.72,6.35 v45.72,7.11 | 33.4,17.65 C9.2 | U$1.6 40.51,25.15 40.51,25.78 U$1.5 40.35,25.81 42.01,25.81 42.42,26.23 42.42,28.38 v42.67,28.64 | 48.07,22.42 49.15,23.5 50.29,23.5 51.05,24.26 51.82,24.26 U$1.27 | 48.07,22.42 46.23,20.57 46.23,19.43 U$1.17 | 34.8,39.75 34.8,40.26 SV2.4 | LTX.C 68.45,12.57 68.45,14.22 LRX.C 68.33,14.35 66.42,16.26 C8.2 66.29,16.38 66.04,16.64 64.14,16.64 62.48,18.29 | 62.48,18.29 62.23,18.54 62.23,20.45 61.09,21.59 60.58,21.59 U$4.10 | v61.85,17.65 62.48,18.29
  Top 0.61: 33.4,17.65 33.4,18.8 33.66,19.05 U$2.P$6 | X1.GND 41.27,38.36 v41.27,36.39
  Top 1.27: IC1.2 55.05,36.99 v55.05,37.02 57.28,37.02 57.28,36.2
  Bottom 0.254: v38.32,29.11 38.32,27.59 C3.2 | 50.26,26.57 IC2.7 50.42,26.67 50.42,30.61 51.94,32.13 51.94,32.64 C1.2 52.07,32.77 52.07,34.04 v55.05,37.02 | IC2.3 49.66,20.7 49.15,20.7 IC2.4 49.02,20.57 48.64,20.19 44.32,20.19 43.18,21.34 43.18,21.59 U$5.P$4 | IC2.3 49.78,20.7 50.29,20.7 IC2.2 50.42,20.7 50.93,20.7 IC2.1 51.05,20.57 51.94,19.68 52.45,19.68 C6.2 | IC2.3 49.78,20.57 49.78,17.14 51.44,15.49 v51.53,15.4 | v61.85,17.65 59.94,17.65 R7.1
  Bottom 0.61: U$3.4 32.2,22.23 U$2.P$6
  pour Route2: 36.83,32.7 28.89,32.7 28.89,13.97 28.83,1.14 38.1,1.27 71.12,1.27 71.12,45.72 36.89,45.78
  pour Route2: 36.83,45.78 36.83,32.7 28.89,32.7 28.89,45.78

### Text on the board
tPlace: HS | SC | TERM
tNames: Controller Board | Version 0.B.3 ('09) | LTU Formula Hybrid | CAN1 | POW | CAN2 | Designed By Zack Bloom